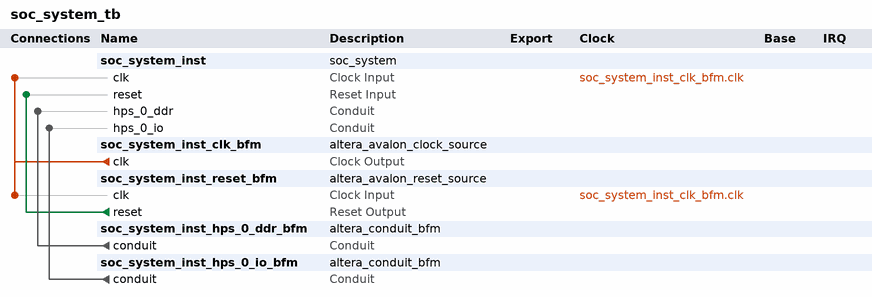
[diagram p0: system contents]
# Platform Designer (Qsys) system soc_system_tb, Cyclone V 5CSEMA5F31C6
# Parameters at their usual value, and those the tool derives, are not listed.
package require -exact qsys 24.1
create_system soc_system_tb
set_project_property DEVICE_FAMILY {Cyclone V}
set_project_property DEVICE 5CSEMA5F31C6

add_instance soc_system_inst soc_system 1.0
set_instance_parameter_value soc_system_inst new_parameter_0 0

add_instance soc_system_inst_clk_bfm altera_avalon_clock_source 24.1

add_instance soc_system_inst_reset_bfm altera_avalon_reset_source 24.1
set_instance_parameter_value soc_system_inst_reset_bfm ASSERT_HIGH_RESET 0
set_instance_parameter_value soc_system_inst_reset_bfm INITIAL_RESET_CYCLES 50

add_instance soc_system_inst_hps_0_ddr_bfm altera_conduit_bfm 24.1
set_instance_parameter_value soc_system_inst_hps_0_ddr_bfm CLOCKED_SIGNAL false
set_instance_parameter_value soc_system_inst_hps_0_ddr_bfm ENABLE_RESET false
set_instance_parameter_value soc_system_inst_hps_0_ddr_bfm SIGNAL_DIRECTIONS input,input,input,input,input,input,input,input,bidir,bidir,bidir,input,input,input,input,output
set_instance_parameter_value soc_system_inst_hps_0_ddr_bfm SIGNAL_ROLES mem_a,mem_ba,mem_cas_n,mem_ck,mem_ck_n,mem_cke,mem_cs_n,mem_dm,mem_dq,mem_dqs,mem_dqs_n,mem_odt,mem_ras_n,mem_reset_n,mem_we_n,oct_rzqin
set_instance_parameter_value soc_system_inst_hps_0_ddr_bfm SIGNAL_WIDTHS 15,3,1,1,1,1,1,4,32,4,4,1,1,1,1,1

add_instance soc_system_inst_hps_0_io_bfm altera_conduit_bfm 24.1
set_instance_parameter_value soc_system_inst_hps_0_io_bfm CLOCKED_SIGNAL false
set_instance_parameter_value soc_system_inst_hps_0_io_bfm ENABLE_RESET false
set_instance_parameter_value soc_system_inst_hps_0_io_bfm SIGNAL_DIRECTIONS input,bidir,output,output,output,output,output,output,input,input,input,input,input,input,bidir,input,bidir,bidir,bidir,bidir,bidir,output,input
set_instance_parameter_value soc_system_inst_hps_0_io_bfm SIGNAL_ROLES hps_io_emac1_inst_MDC,hps_io_emac1_inst_MDIO,hps_io_emac1_inst_RXD0,hps_io_emac1_inst_RXD1,hps_io_emac1_inst_RXD2,hps_io_emac1_inst_RXD3,hps_io_emac1_inst_RX_CLK,hps_io_emac1_inst_RX_CTL,hps_io_emac1_inst_TXD0,hps_io_emac1_inst_TXD1,hps_io_emac1_inst_TXD2,hps_io_emac1_inst_TXD3,hps_io_emac1_inst_TX_CLK,hps_io_emac1_inst_TX_CTL,hps_io_gpio_inst_GPIO35,hps_io_sdio_inst_CLK,hps_io_sdio_inst_CMD,hps_io_sdio_inst_D0,hps_io_sdio_inst_D1,hps_io_sdio_inst_D2,hps_io_sdio_inst_D3,hps_io_uart0_inst_RX,hps_io_uart0_inst_TX
set_instance_parameter_value soc_system_inst_hps_0_io_bfm SIGNAL_WIDTHS 1,1,1,1,1,1,1,1,1,1,1,1,1,1,1,1,1,1,1,1,1,1,1

# connections
add_connection soc_system_inst_clk_bfm.clk soc_system_inst.clk clock
add_connection soc_system_inst_clk_bfm.clk soc_system_inst_reset_bfm.clk clock
add_connection soc_system_inst_reset_bfm.reset soc_system_inst.reset reset
add_connection soc_system_inst_hps_0_ddr_bfm.conduit soc_system_inst.hps_0_ddr conduit
add_connection soc_system_inst_hps_0_io_bfm.conduit soc_system_inst.hps_0_io conduit

set_interconnect_requirement {$system} qsys_mm.clockCrossingAdapter HANDSHAKE
set_interconnect_requirement {$system} qsys_mm.enableEccProtection FALSE
set_interconnect_requirement {$system} qsys_mm.insertDefaultSlave FALSE
set_interconnect_requirement {$system} qsys_mm.maxAdditionalLatency 1

save_system soc_system_tb.qsys
